# Altium project Arduino nano.PrjPcb
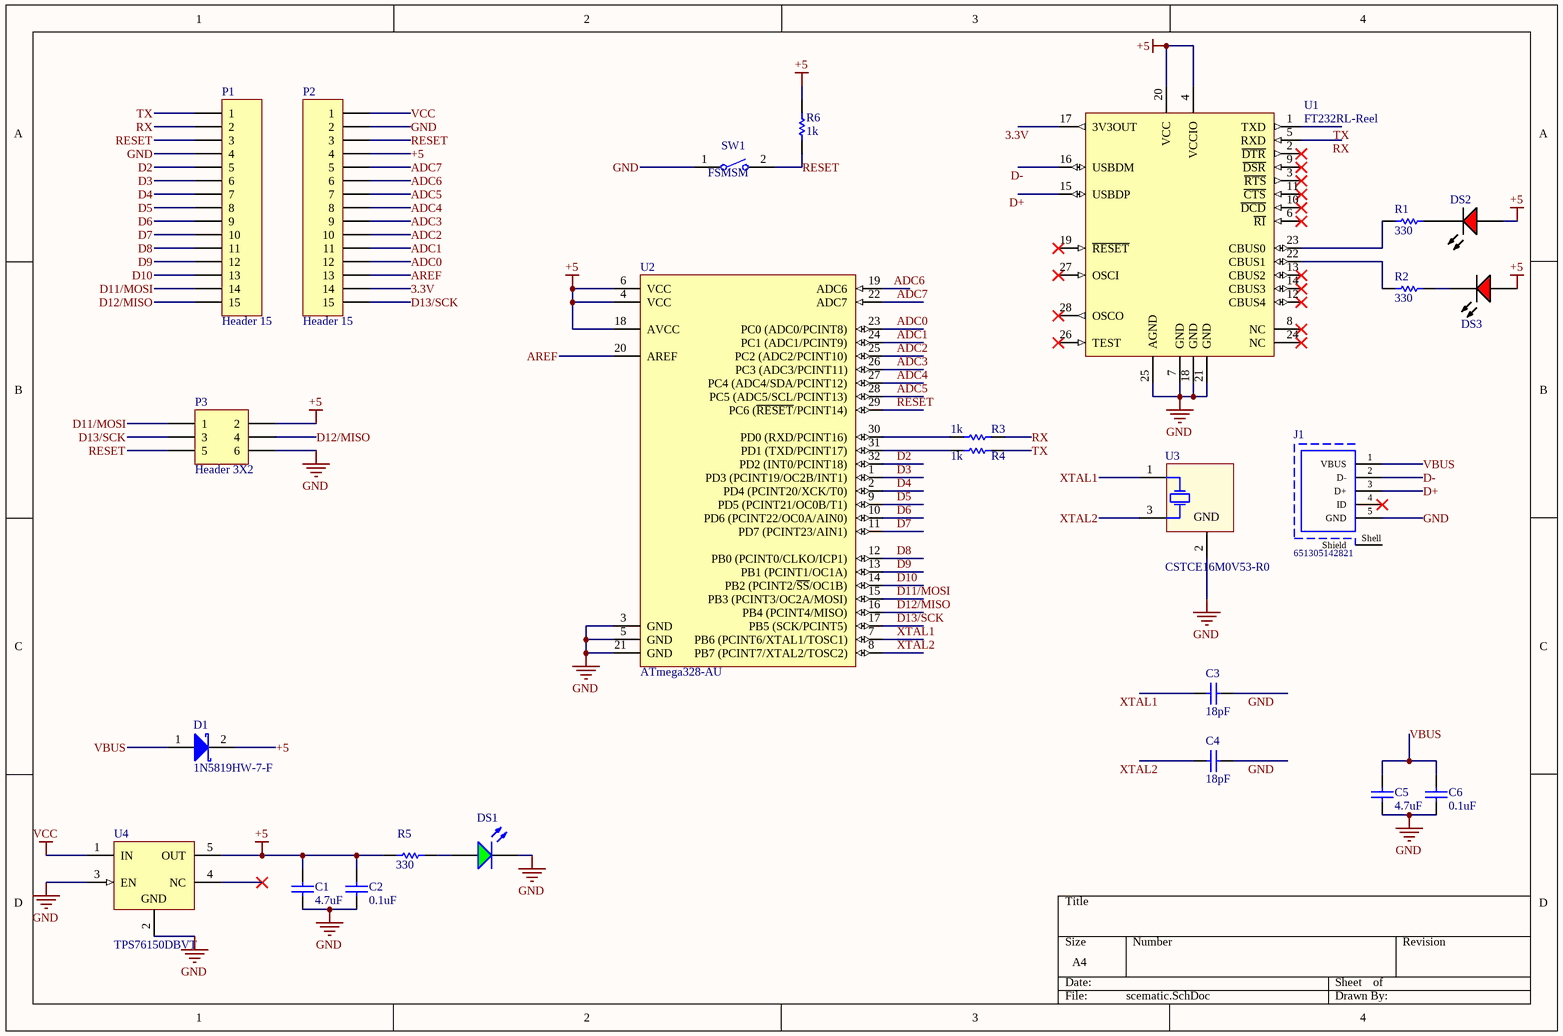
[diagram p0: scematic.SchDoc]
1 sheet, 25 parts. Net scope: global (net labels, ports and power ports of the same name join across sheets).
Board file: PCB1.PcbDoc

## Sheet scematic.SchDoc
size A4

### Parts
C1  4.7uF  [CAPC1005X55X25NL05T10]
C2  0.1uF  [CAPC1005X55X25ML05T10]
C3  18pF  [CAPC1005X55X30LL05T10]
C4  18pF  [CAPC1005X55X30LL05T10]
C5  4.7uF  [CAPC1005X55X25NL05T10]
C6  0.1uF  [CAPC1005X55X25ML05T10]
D1  1N5819HW-7-F  [DIOD-SOD-123-2_V]
DS1  APT1608SGC  [KING-APT1608SGC_V]  (value not drawn)
DS2  TLMS1000-GS08  [VISH-TLMS1000_V]  (value not drawn)
DS3  TLMS1000-GS08  [VISH-TLMS1000_V]  (value not drawn)
J1  651305142821  [651305142821]
P1  Header 15  [HDR1X15]
P2  Header 15  [HDR1X15]
P3  Header 3X2  [HDR2X3]
R1  330  [RESC1608X55X30ML15T15]
R2  330  [RESC1608X55X30ML15T15]
R3  1k  [RESC1608X55X30ML15T15]
R4  1k  [RESC1608X55X30ML15T15]
R5  330  [RESC1608X55X30ML15T15]
R6  1k  [RESC1608X55X30ML15T15]
SW1  FSMSM  [TECO-FSMSM-2_V]
U1  FT232RL-Reel  [SSOP-28_L]
U2  ATmega328-AU  [32A_L]
U3  CSTCE16M0V53-R0  [MURA-CSTCE_V-3_V]
U4  TPS76150DBVT  [DBV0005A_N]

### Nets
+5: C1.2 C2.2 D1.2(K) DS2.1(A) DS3.1(A) P2.4 P3.2 R5.1 R6.2 U1.4(VCCIO) U1.20(VCC) U2.4(VCC) U2.6(VCC) U2.18(AVCC) U4.5(OUT)
GND: C1.1 C2.1 C3.2 C4.2 C5.1 C6.1 DS1.2(K) J1.5(GND) P1.4 P2.2 P3.6 SW1.1 U1.7(GND) U1.18(GND) U1.21(GND) U1.25(AGND) U2.3(GND) U2.5(GND) U2.21(GND) U3.2(GND) U4.2(GND) U4.3(EN)
VCC: P2.1 U4.1(IN)
3.3V: P2.14 U1.17(3V3OUT)
ADC0: P2.12 U2.23(PC0_(ADC0/PCINT8))
ADC1: P2.11 U2.24(PC1_(ADC1/PCINT9))
ADC2: P2.10 U2.25(PC2_(ADC2/PCINT10))
ADC3: P2.9 U2.26(PC3_(ADC3/PCINT11))
ADC4: P2.8 U2.27(PC4_(ADC4/SDA/PCINT12))
ADC5: P2.7 U2.28(PC5_(ADC5/SCL/PCINT13))
ADC6: P2.6 U2.19(ADC6)
ADC7: P2.5 U2.22(ADC7)
AREF: P2.13 U2.20(AREF)
D2: P1.5 U2.32(PD2_(INT0/PCINT18))
D3: P1.6 U2.1(PD3_(PCINT19/OC2B/INT1))
D4: P1.7 U2.2(PD4_(PCINT20/XCK/T0))
D5: P1.8 U2.9(PD5_(PCINT21/OC0B/T1))
D6: P1.9 U2.10(PD6_(PCINT22/OC0A/AIN0))
D7: P1.10 U2.11(PD7_(PCINT23/AIN1))
D8: P1.11 U2.12(PB0_(PCINT0/CLKO/ICP1))
D9: P1.12 U2.13(PB1_(PCINT1/OC1A))
D10: P1.13 U2.14(PB2_(PCINT2/~{SS}/OC1B))
D11/MOSI: P1.14 P3.1 U2.15(PB3_(PCINT3/OC2A/MOSI))
D12/MISO: P1.15 P3.4 U2.16(PB4_(PCINT4/MISO))
D13/SCK: P2.15 P3.3 U2.17(PB5_(SCK/PCINT5))
D+: J1.3(D+) U1.15(USBDP)
D-: J1.2(D-) U1.16(USBDM)
RESET: P1.3 P2.3 P3.5 R6.1 SW1.2 U2.29(PC6_(~{RESET}/PCINT14))
RX: P1.2 R3.2 U1.5(RXD)
TX: P1.1 R4.2 U1.1(TXD)
VBUS: C5.2 C6.2 D1.1(A) J1.1(VBUS)
XTAL1: C3.1 U2.7(PB6_(PCINT6/XTAL1/TOSC1)) U3.1(C1)
XTAL2: C4.1 U2.8(PB7_(PCINT7/XTAL2/TOSC2)) U3.3(C2)
NetDS1_1: DS1.1(A) R5.2
NetDS2_2: DS2.2(K) R1.2
NetDS3_2: DS3.2(K) R2.2
NetR1_1: R1.1 U1.23(CBUS0)
NetR2_1: R2.1 U1.22(CBUS1)
NetR3_1: R3.1 U2.30(PD0_(RXD/PCINT16))
NetR4_1: R4.1 U2.31(PD1_(TXD/PCINT17))

Not connected (* = marked no-connect by the designer): J1 4(ID)* Shell(Shield); U1 2(~{DTR})* 3(~{RTS})* 6(~{RI})* 8(NC)* 9(~{DSR})* 10(~{DCD})* 11(~{CTS})* 12(CBUS4)* 13(CBUS2)* 14(CBUS3)* 19(~{RESET})* 24(NC)* 26(TEST)* 27(OSCI)* 28(OSCO)*; U4 4(NC)*

### Library data of the parts
C1 C5 = CMP-2008-04549-1: Part Number: GRM155R60J475ME47D; Manufacturer: Murata
C2 C6 = CMP-2100-03641-1: Chip Capacitor, 0.1 uF, +/- 10%, 16 V, -55 to 125 degC, 0402 (1005 Metric), RoHS, Tape and Reel; Manufacturer: Murata; Material: Ceramic; Insulation Resistance: 10GR; Voltage: 16V; Dielectric: X7R; Capacitance: 100nF; REACH SVHC: NoSVHC; Depth: 0.5mm; Case/Package: 0402; Datasheet URL: http://psearch.en.murata.com/capacitor/product/GRM155R71C104KA88%23.pdf; Lead Free: LeadFree; Dielectric Material: Ceramic; Manufacturer URL: http://www.murata.com/; Min Operating Temperature: -55degC; Length: 1mm; Case Code (Metric): 1005; Radiation Hardening: No; Package Reference: 0402; RoHSCompliant: true; Datasheet Version: 42675.0; Thickness: 0.022inch; Packaging: TapeandReel; Voltage Rating (DC): 16V; Tolerance: 10%; Max Operating Temperature: 125degC; Package Description: 2-Pin Surface Mount Device, Body 1 x 0.5 mm; Mount: SurfaceMount; Height: 0.5mm; Width: 0.5mm; Number of Pins: 2; Voltage Rating: 16V; Case Code (Imperial): 0402; Termination: SMD/SMT; Package Quantity: 1
C3 C4 = CMP-2008-03288-1: Part Number: C0402C180J5GACTU; Manufacturer: Kemet
D1 = CMP-0303-00003-1: 1.0 A Surface Mount Schottky Barrier Rectifier, 40 V, -65 to 125 degC, 2-Pin SOD-123 Package, RoHS, Tape and Reel; Manufacturer: Diodes Inc; @ VR (V): 40; @ Terminal Temperature TT (degC): 90; Maximum Average Rectified Current IO (A): 1; Total Capacitance CT (pF): 50; Peak Forward Surge Current IFSM (A): 25; Forward Voltage Drop VF (V): 0.45; VR (RMS) (V): 28; RoHS: TRUE; PartNumber: 1N5819HW-7-F; ComponentLink2URL: http://www.diodes.com/datasheets/ds30217.pdf; PackageDescription: 2-Pin SOD-123, Body 2.7 x 1.55 mm, Pitch 3.7 mm; @ IF (A): 1; Operating and Storage Temperature Range: -65 to 125 degC; ComponentLink1Description: Manufacturer URL; ComponentLink2Description: Datasheet; ComponentLink1URL: http://www.diodes.com/; Mounting Technology: Surface Mount; DatasheetVersion: Rev. 15-2; PackageReference: SOD-123-2; Maximum Reverse Current IR (uA): 50; Peak Repetitive Reverse Voltage VRRM (V): 40; Packing: Tape and Reel
DS1 = CMP-2000-05789-1: Super Bright Green LED, 62.5 mW, 25 mA, -40 to 85 degC, 2-Pin SMD, RoHS, Tape and Reel; Manufacturer: Kingbright; Online Catalog: 0603RectanglewithFlatTopChipLEDs; Wavelength - Dominant: 568nm; Wavelength - Peak: 565nm; Voltage - Forward (Vf) (Typ): 2.2V; Lens Type: Clear; Other Names: 754-1121-2; Millicandela Rating: 15mcd; Catalog Drawings: APT1608SeriesTop / APT1608SeriesSide; Lens Style/Size: RectanglewithFlatTop,1.2mmx0.8mm; Current - Test: 20mA; 3D Model: APT1608x.sldprt / APT1608x.pro / APT1608x.igs / APT1608x.stp; Viewing Angle: 120°; Package / Case: 0603(1608Metric); Category: Optoelectronics; Package Description: 2-Pin Surface Mount Device, Body 0.8 x 1.6 mm; Mounting Type: SurfaceMount; Color: Green; Height: 0.75mm; Datasheet Version: Rev. 16B, 02/2012; Family: LEDIndication-Discrete; Manufacturer URL: http://www.kingbright.com/; Package Reference: APT1608SGC; Datasheet URL: https://datasheet.ciiva.com/2113/apt1608sgc-2113808.pdf; Mounting Technology: SurfaceMount; Packaging: Tape&Reel(TR); Standard Package: 2,000; Size / Dimension: 1.60mmLx0.80mmW
DS2 DS3 = CMP-2000-07254-1: Low Current LED, 40 mW, 1.8 V, -40 to 100 degC, 2-Pin SMD (0603), RoHS, Tape and Reel; Manufacturer: Vishay; Lens Shape: Rectangular; Automotive Qualification Standard: AEC-Q100; Wavelength Typ: 636nm; SVHC: ToBeAdvised; LED Colour: Red; Bulb Size: 1.6mmx0.8mm; Forward Voltage: 1.8V; Luminous Intensity: 4mcd; Forward Current If: 2mA; Viewing Angle: 80°; Datasheet Version: Rev. 1.7, 02/2011; Datasheet URL: https://datasheet.ciiva.com/5798/1698881-5798337.pdf; LED Mounting: SMD; Packaging: CutTape; Package Reference: TLMS1000; Manufacturer URL: http://www.vishay.com/; Mounting Technology: SurfaceMount; Product Range: -; Package Description: 2-Pin Surface Mount Device, Body 1.6 x 0.8 mm; MSL: MSL2-1year
J1 = CMP-1502-03247-1: Mini USB 2.0 Type AB Receptacle WR-COM, Horizontal, SMT, with Pads; Manufacturer: Wurth Elektronik; Rated Current: 1A; Contact Resistance: 20mOhm; Working Voltage: 30VAC; Publisher: WurthElektronik; Connector Type: MiniUSB2.0TypeAB; Manufacturer URL: http://www.we-online.de; Part Number: 651305142821; Packaging: TapeandReel; Gender: Receptacle; Package Reference: 651305142821; Datasheet URL: https://katalog.we-online.de/em/datasheet/651305142821.pdf; Operating Temperature: -40to105degC; Mounting Technology: SMT; Orientation: Horizontal
P1 P2 = Header 15: Header, 15-Pin; LatestRevisionDate: 17-Jul-2002; LatestRevisionNote: Re-released for DXP Platform.; Publisher: Altium Limited
P3 = Header 3X2: Header, 3-Pin, Dual row; LatestRevisionDate: 17-Jul-2002; LatestRevisionNote: Re-released for DXP Platform.; Publisher: Altium Limited
R1-R6 = CMP-2000-00772-1: Part Number: ERJ-3GEYJ331V; Manufacturer: Panasonic
SW1 = CMP-2000-07511-1: FSMSM Push Button Switch, 50 mA, -35 to 85 degC, 2-Pin SMD, RoHS, Bulk; Manufacturer: TE Connectivity; Actuator Length: 1.07mm; Electrical Life: 20000Cycles; Actuator Material: Polyamide; Current Rating: 50mA; Illumination Type: Illuminated; Voltage Rating (DC): 24V; Contact Resistance: 100mOhm; Case\/Package: SMD/SMT; Operating Force: 180gf; Switch Travel: 0.25mm; Max Voltage Rating (DC): 12V; Throw Configuration: SPST; Packaging: LoosePiece; Max Operating Temperature: 85degC; ELV: Compliant; Package Description: 2-Pin Surface Mount Device, Body 6 x 3.5 mm, Pitch 9.19 mm; RoHSCompliant: true; Manufacturer URL: http://www.te.com/; Contact Plating: Silver; Contact Material: Brass; Mounting Technology: SurfaceMount; Contact Current Rating: 50mA; Datasheet Version: Rev. C2, 08/2014; Datasheet URL: http://www.te.com/commerce/DocumentDelivery/DDEController?Action=showdoc&DocId=Customer+Drawing%7F1437566-3%7FC2%7Fpdf%7FEnglish%7FENG_CD_1437566-3_C2_1437566_3_1_c.dwg.pdf%7F1437566-3; Mechanical Life: 20000Cycles; Package Reference: FSMSM; REACH SVHC: Unknown; Orientation: Straight; Min Operating Temperature: -35degC; Lead Free: LeadFree; Termination: GullWing; Package Quantity: 1000; Mount: SurfaceMount
U1 = CMP-0078-00029-3: USB UART Asynchronous Serial Data Transfer Chip, 28-pin SSOP, Tape and Reel; Manufacturer: FTDI; PackageVersion: Mar-12; PackageReference: SSOP-28; ComponentLink2Description: Datasheet; DatasheetVersion: ver 2.10, Mar-2012; PackageDescription: 28-Pin Small Outline Package 0.65 mm Pitch; ComponentLink1Description: Manufacturer URL; RevisionNote: DatasheetVersion updated to 2.10 Mar-2012; PartNumber: FT232RL-Reel; ComponentLink1URL: http://www.ftdichip.com/; ComponentLink2URL: http://www.ftdichip.com/Support/Documents/DataSheets/ICs/DS_FT232R.pdf
U2 = CMP-0095-00261-2: 8-bit AVR Microcontroller, 32KB Flash, 1KB EEPROM, 2KB SRAM, 32-pin TQFP, Industrial Grade (-40°C to 85°C); DatasheetVersion: revD, May-2011; ComponentLink3Description: ATmega48A/48PA/88A/88PA/168A/168PA/328/328P Summary; Code_JEDEC: MS-026-ABA; ComponentLink1URL: http://www.atmel.com/; RevisionNote: DatasheetVersion & PackageVersion updated. URLs added.; ComponentLink2Description: ATmega48A/48PA/88A/88PA/168A/168PA/328/328P Datasheet; ComponentLink1Description: Manufacturer URL; ComponentLink2URL: http://www.atmel.com/dyn/resources/prod_documents/doc8271.pdf; PackageReference: 32A; ComponentLink3URL: http://www.atmel.com/dyn/resources/prod_documents/8271S.pdf; PackageDescription: 32-Lead, 7x7x1.0 mm Body, 0.8mm Lead Pitch, Thin Profile Plastic Quad Flat Package (TQFP); PackageVersion: revC, Oct-2010
U3 = CMP-0588-00001-2: Ceramic Resonator, 16 MHz with Built-in Capacitance, Thickness Expander Mode, Initial Frequency Tolerance +/- 0.5%, Load Capacity 15 pF, -20 to 80 degC, 3.2 x 1.3 x 1 mm SMD, RoHS, Reel; Manufacturer: Murata; Oscillating Frequency: 16 MHz; Load Capacity: 15 pF; PackageDescription: 3-Pin SMD, Body 3.2 x 1.3 mm, Pitch 0.95 mm; Mounting Technology: Surface Mount; ComponentLink1URL: http://www.murata.com/; RoHS: TRUE; Packing: Reel; Initial Frequency Tolerance: +/- 0.5%; PartNumber: CSTCE16M0V53-R0; ComponentLink2Description: Datasheet; DatasheetVersion: Rev. P16E-22; PackageReference: CSTCE_V-3; Operating Temperature Range: -20 to 80 degC; ComponentLink2URL: http://www.murata.com/products/catalog/pdf/p16e.pdf; ComponentLink1Description: Manufacturer URL; Initial Tolerance: +/- 0.5%
U4 = CMP-0394-00728-2: Single Output LDO, 100 mA, Fixed 5 V Output, 5.38 to 16 V Input, with Low IQ, 5-pin SOT-23 (DBV), -40 to 125 degC, Green (RoHS & no Sb/Br); Manufacturer: Texas Instruments; Vin(Min)(V): 5.38; Iout(Max)(A): 0.1; Vout Adj(Max)(V): 5; Accuracy(%): 2; Vdo(Typ)(mV): 170; Iq(Typ)(mA): 2.6; SubFamily: Single Channel LDO; Vin(Max)(V): 16; ComponentLink1URL: http://www.ti.com/; Eco-Plan: Green (RoHS & no Sb/Br); Mounting Technology: Surface Mount; ComponentLink2Description: Datasheet; PackageVersion: 4073253-4/K; DatasheetVersion: SLVS178B; PartNumber: TPS76150DBVT; ComponentLink3URL: http://www.ti.com/litv/pdf/mpds018i; Vout Adj(Min)(V): 5; PackageDescription: 5-Pin Plastic Small Outline, Body 1.60 Ãƒâ€” 2.90 mm, Pitch 0.95 mm; ComponentLink2URL: http://www.ti.com/general/docs/lit/getliterature.tsp?genericPartNumber=TPS76150&fileType=pdf; ComponentLink1Description: Manufacturer URL; Code_JEDEC: MO-178; PackageReference: DBV0005A; ComponentLink3Description: Package Specification; Fixed Output Options(V): 5